# EAGLE design center (EAGLE 9.1.3)
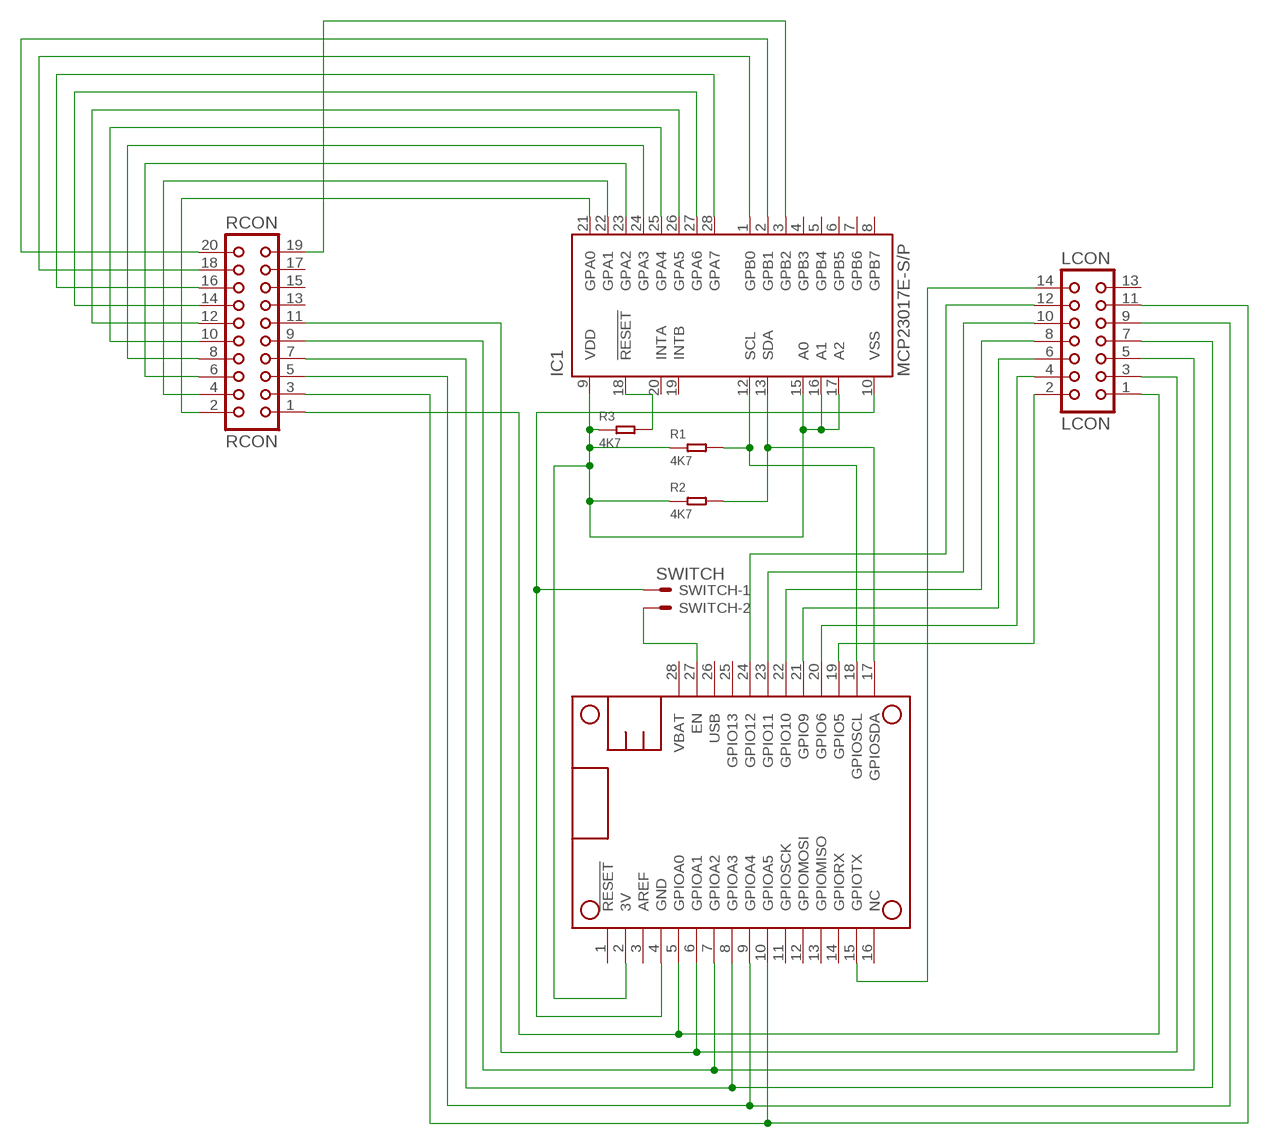
[diagram p0: schematic, sheet 1]

## Parts
IC1  MCP23017E-S/P  MCP23017SP  [DIL28-3]
LCON  LCON  CON14  [CON14]
MS1  FEATHERWING_NODIM  [FEATHERWING_DIM]
R1  4K7  DIP-RES-4.7K-5%-1/4W(PR-D2.3XL6.5MM)  [PR-D2.3XL6.5MM]
R2  4K7  DIP-RES-4.7K-5%-1/4W(PR-D2.3XL6.5MM)  [PR-D2.3XL6.5MM]
R3  4K7  DIP-RES-4.7K-5%-1/4W(PR-D2.3XL6.5MM)  [PR-D2.3XL6.5MM]
RCON  RCON  CON20  [CON20]
SWITCH  SWITCH  JST-XH-02-PIN-LONG-PAD  [JST-XH-02-PACKAGE-LONG-PAD]

## Nets
3V: IC1.9(VDD) IC1.15(A0) IC1.16(A1) IC1.17(A2) MS1.2(3V) R1.1 R2.1 R3.1
EN: MS1.27(EN) SWITCH.2
GND: IC1.10(VSS) MS1.4(GND) SWITCH.1
LCOL1: LCON.2 MS1.19(GPIO5)
LCOL2: LCON.4 MS1.20(GPIO6)
LCOL3: LCON.6 MS1.21(GPIO9)
LCOL4: LCON.8 MS1.22(GPIO10)
LCOL5: LCON.10 MS1.23(GPIO11)
LCOL6: LCON.12 MS1.24(GPIO12)
LCOL7: LCON.14 MS1.15(GPIOTX)
RCOL1: IC1.21(GPA0) RCON.2
RCOL2: IC1.22(GPA1) RCON.4
RCOL3: IC1.23(GPA2) RCON.6
RCOL4: IC1.24(GPA3) RCON.8
RCOL5: IC1.25(GPA4) RCON.10
RCOL6: IC1.26(GPA5) RCON.12
RCOL7: IC1.27(GPA6) RCON.14
RCOL8: IC1.28(GPA7) RCON.16
RCOL9: IC1.1(GPB0) RCON.18
RCOL10: IC1.2(GPB1) RCON.20
RCOL11: IC1.3(GPB2) RCON.19
RESET: IC1.18(!RESET) R3.2
ROW1: LCON.1 MS1.5(GPIOA0) RCON.1
ROW2: LCON.3 MS1.6(GPIOA1) RCON.11
ROW3: LCON.5 MS1.7(GPIOA2) RCON.9
ROW4: LCON.7 MS1.8(GPIOA3) RCON.7
ROW5: LCON.9 MS1.9(GPIOA4) RCON.5
ROW6: LCON.11 MS1.10(GPIOA5) RCON.3
SCL: IC1.12(SCL) MS1.18(GPIOSCL) R1.2
SDA: IC1.13(SDA) MS1.17(GPIOSDA) R2.2
Unconnected: IC1.4(GPB3) IC1.5(GPB4) IC1.6(GPB5) IC1.7(GPB6) IC1.8(GPB7) IC1.19(INTB) IC1.20(INTA) LCON.13 MS1.1(!RESET) MS1.3(AREF) MS1.11(GPIOSCK) MS1.12(GPIOMOSI) MS1.13(GPIOMISO) MS1.14(GPIORX) MS1.16(NC) MS1.25(GPIO13) MS1.26(USB) MS1.28(VBAT) RCON.13 RCON.15 RCON.17

## Library data of the parts
IC1 = adafruit:MCP23017: http://ww1.microchip.com/downloads/en/DeviceDoc/21952a.pdf Source: http://ww1.microchip.com/downloads/en/DeviceDoc/21952a.pdf
LCON = con-harting:CON14: CONNECTOR; OC_FARNELL: unknown; OC_NEWARK: unknown
MS1 = adafruit:FEATHERWING
R1-R3 = Seeed-Resistor:DIP-RES-4.7K-5%-1/4W(PR-D2.3XL6.5MM): 301020012; MPN: FHCFR-1/4W-472J; VALUE: 4.7K
RCON = con-harting:CON20: CONNECTOR; OC_FARNELL: unknown; OC_NEWARK: unknown
SWITCH = Rembrandt Electronics - JST XH Connectors v1-0:JST-XH-02-PIN: JST XH Connector 2 Pin Wire to board connector. Pitch: 2,54 mm, (0.100") Number of pins: 2 Created by Rembrandt Electronics www.rembrandtelectronics.com

## Board
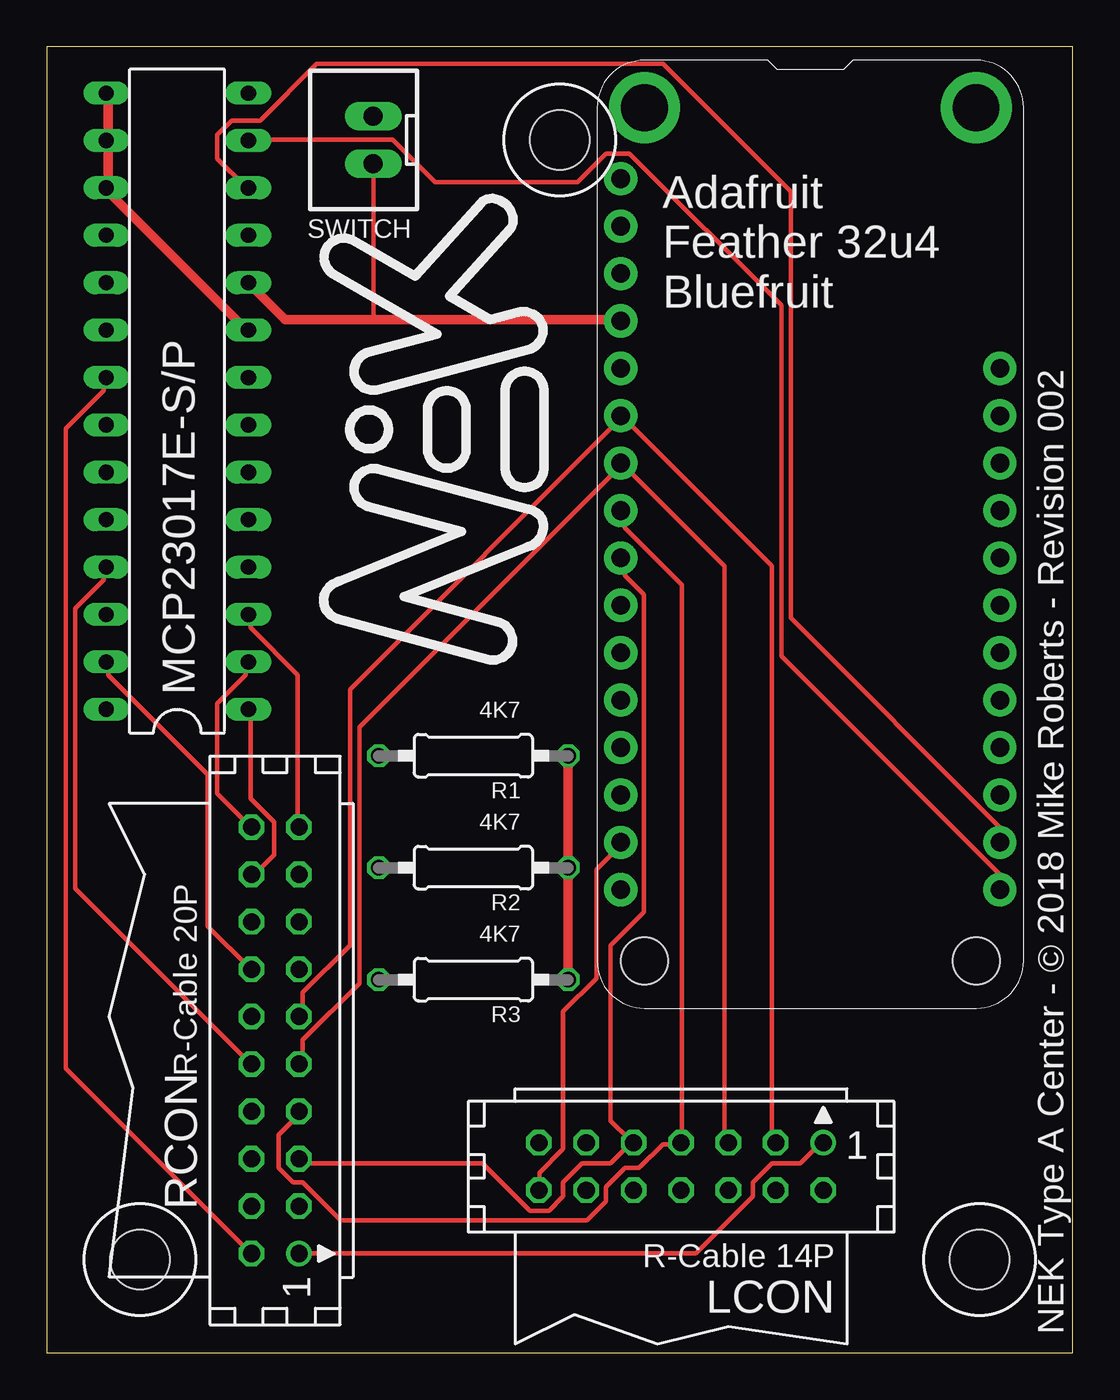
[diagram p1: board, top side]
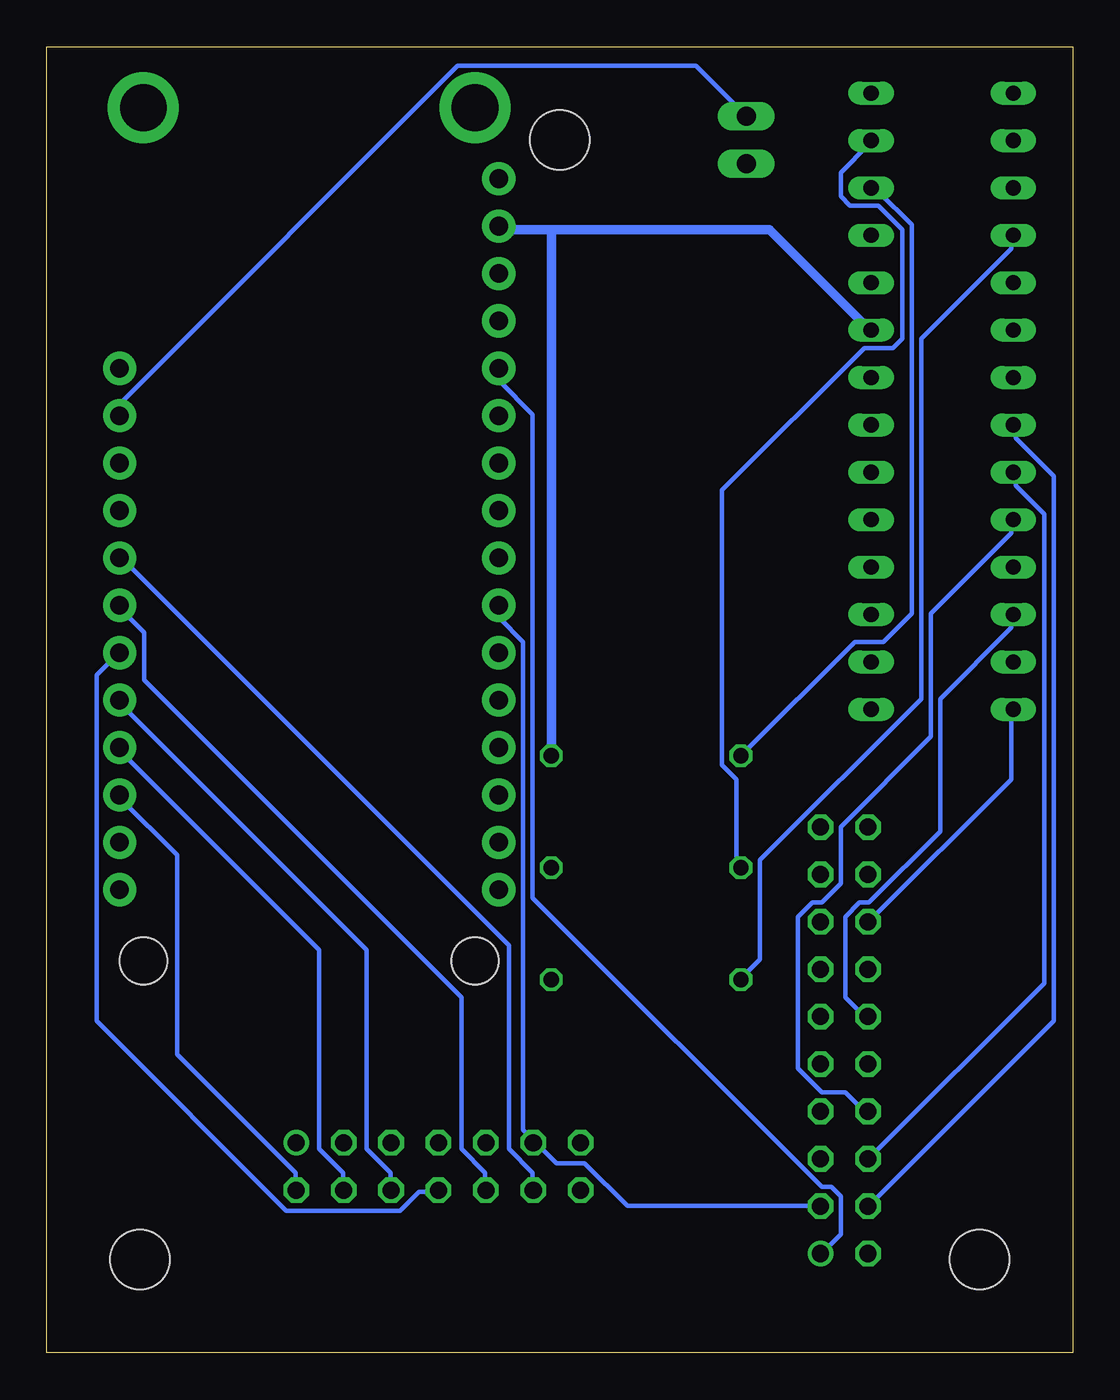
[diagram p2: board, bottom side, seen from below]

Size 55 x 70 mm. Coordinates in mm from the lower left corner, seen from the top.
Outline: 0,0 55,0 55,70 0,70 0,0
Copper layers (1*16): Top 0.035559375mm / dielectric 1.6mm / Bottom 0.035559375mm
Design rules "oshpark-2layer-auto-routing": minimum track width 10mil, minimum drill 10mil, track to track 10mil, track to pad 8mil, pad to pad 8mil, via to via 8mil, smd to smd 6mil, copper to edge 15mil, drill to drill 6mil, minimum pad ring 6mil, minimum via ring 6mil, stop-mask expansion 2.5mil, vias tented up to drill 0mil, thermal gap 10mil
Holes 3.2 mm at 50,5 5,5 27.5,65

### Footprints (pad centres in the part's own frame; a part is rotated, then mirrored left to right if it is on the bottom)
DIL28-3 = drill 0.813 long: 1 -16.51,-3.81; 2 -13.97,-3.81; 3 -11.43,-3.81; 4 -8.89,-3.81; 5 -6.35,-3.81; 6 -3.81,-3.81; 7 -1.27,-3.81; 8 1.27,-3.81; 9 3.81,-3.81; 10 6.35,-3.81; 11 8.89,-3.81; 12 11.43,-3.81; 13 13.97,-3.81; 14 16.51,-3.81; 15 16.51,3.81; 16 13.97,3.81; 17 11.43,3.81; 18 8.89,3.81; 19 6.35,3.81; 20 3.81,3.81; 21 1.27,3.81; 22 -1.27,3.81; 23 -3.81,3.81; 24 -6.35,3.81; 25 -8.89,3.81; 26 -11.43,3.81; 27 -13.97,3.81; 28 -16.51,3.81
CON14 = drill 0.914: 1 -7.62,-1.27 | drill 0.914 octagon: 2 -7.62,1.27; 3 -5.08,-1.27; 4 -5.08,1.27; 5 -2.54,-1.27; 6 -2.54,1.27; 7 0,-1.27; 8 0,1.27; 9 2.54,-1.27; 10 2.54,1.27; 11 5.08,-1.27; 12 5.08,1.27; 13 7.62,-1.27; 14 7.62,1.27
FEATHERWING_DIM = drill 1 pad 1.778: 1 6.35,1.27; 2 8.89,1.27; 3 11.43,1.27; 4 13.97,1.27; 5 16.51,1.27; 6 19.05,1.27; 7 21.59,1.27; 8 24.13,1.27; 9 26.67,1.27; 10 29.21,1.27; 11 31.75,1.27; 12 34.29,1.27; 13 36.83,1.27; 14 39.37,1.27; 15 41.91,1.27; 16 44.45,1.27; 17 44.45,21.59; 18 41.91,21.59; 19 39.37,21.59; 20 36.83,21.59; 21 34.29,21.59; 22 31.75,21.59; 23 29.21,21.59; 24 26.67,21.59; 25 24.13,21.59; 26 21.59,21.59; 27 19.05,21.59; 28 16.51,21.59 | drill 2.5 pad 3.81: P$1 2.54,20.32; P$2 2.54,2.54 | hole 2.54: 48.26,20.32; 48.26,2.54
PR-D2.3XL6.5MM = drill 0.813 octagon: 1 -4.953,0; 2 5.207,0
CON20 = drill 0.914: 1 -11.43,-1.27 | drill 0.914 octagon: 2 -11.43,1.27; 3 -8.89,-1.27; 4 -8.89,1.27; 5 -6.35,-1.27; 6 -6.35,1.27; 7 -3.81,-1.27; 8 -3.81,1.27; 9 -1.27,-1.27; 10 -1.27,1.27; 11 1.27,-1.27; 12 1.27,1.27; 13 3.81,-1.27; 14 3.81,1.27; 15 6.35,-1.27; 16 6.35,1.27; 17 8.89,-1.27; 18 8.89,1.27; 19 11.43,-1.27; 20 11.43,1.27
JST-XH-02-PACKAGE-LONG-PAD = drill 1.016 long: 1 -1.27,0; 2 1.27,0

### Placement (x,y rotation side)
IC1  7,51 90 top
LCON  34,9.99 180 top
MS1  29.5,69.27 270 top
R1  23,32 180 top
R2  23,26 180 top
R3  23,20 180 top
RCON  12.25,16.75 90 top
SWITCH  17.5,65 90 top

### Tracks (layer width: path | path; a pad name or v marks a point on that pad's centre or on a via)
3V
  Top 0.254: 27.94,20.07 R3.1 | 27.94,25.91 R2.1 27.94,26.16 | 27.94,31.75 R1.1 | 3.3,62.48 IC1.17 3.3,62.23 | 3.3,64.77 IC1.16 3.3,65.02 | 10.67,54.86 IC1.9 | 3.3,67.31 IC1.15
  Top 0.5: 27.94,25.91 27.94,20.07 | 27.94,26.16 27.94,31.75 | 3.3,64.77 3.3,62.48 | 3.3,62.23 10.67,54.86 | 3.3,65.02 3.3,67.31
  Bottom 0.254: 30.73,60.2 MS1.2 | 10.92,54.86 IC1.9 | R1.1
  Bottom 0.5: 27.94,60.2 16.26,60.2 10.92,54.86 | 27.94,60.2 30.73,60.2 | 27.94,60.2 R1.1
EN
  Bottom 0.254: SWITCH.2 20.2,68.97 32.97,68.97 51.09,50.84 MS1.27
GND
  Top 0.254: 30.73,55.37 MS1.4 | 17.53,55.37 17.53,63.5 SWITCH.1
  Top 0.5: 30.73,55.37 25.4,55.37 17.53,55.37 12.79,55.37 IC1.10
LCOL1
  Bottom 0.254: LCON.2 41.66,8.89 41.66,9.65 48.01,16 48.01,26.67 51.05,29.72 MS1.19
LCOL2
  Bottom 0.254: LCON.4 39.12,8.89 39.12,9.65 40.39,10.92 40.39,21.59 51.05,32.26 MS1.20
LCOL3
  Bottom 0.254: LCON.6 36.58,8.89 36.58,9.65 37.85,10.92 37.85,21.59 51.05,34.8 MS1.21
LCOL4
  Bottom 0.254: LCON.8 34.04,8.64 35.05,8.64 36.07,7.62 42.16,7.62 52.32,17.78 52.32,36.32 51.31,37.34 MS1.22
LCOL5
  Bottom 0.254: LCON.10 31.5,8.89 31.5,9.65 32.77,10.92 32.77,19.05 49.78,36.07 49.78,38.61 51.05,39.88 MS1.23
LCOL6
  Bottom 0.254: LCON.12 28.96,8.89 28.96,9.65 30.23,10.92 30.23,21.84 51.05,42.67 MS1.24
LCOL7
  Top 0.254: LCON.14 26.42,8.89 26.42,9.65 27.69,10.92 27.69,18.29 29.46,20.07 29.46,25.91 30.73,27.18 MS1.15
RCOL1
  Top 0.254: IC1.21 3.05,52.07 3.05,51.56 1.02,49.53 1.02,15.24 10.92,5.33 RCON.2
RCOL2
  Bottom 0.254: IC1.22 3.05,49.53 3.05,49.02 1.02,46.99 1.02,17.78 10.92,7.87 RCON.4
RCOL3
  Bottom 0.254: IC1.23 3.05,46.99 3.05,46.48 1.52,44.96 1.52,19.81 10.92,10.41 RCON.6
RCOL4
  Bottom 0.254: IC1.24 3.3,44.45 3.3,43.94 7.62,39.62 7.62,33.02 12.45,28.19 12.45,25.15 13.46,24.13 13.97,24.13 14.73,23.37 14.73,15.24 13.46,13.97 12.19,13.97 11.18,12.95 RCON.8
RCOL5
  Top 0.254: IC1.25 3.05,41.91 3.05,41.4 1.52,39.88 1.52,24.89 10.92,15.49 RCON.10
RCOL6
  Bottom 0.254: IC1.26 3.3,39.37 3.3,38.86 7.11,35.05 7.11,27.94 10.92,24.13 11.43,24.13 12.19,23.37 12.19,19.05 11.18,18.03 RCON.12
RCOL7
  Top 0.254: IC1.27 3.3,36.83 3.3,36.32 8.64,30.99 8.64,22.86 10.92,20.57 RCON.14
RCOL8
  Bottom 0.254: IC1.28 3.3,34.29 3.3,30.73 10.92,23.11 RCON.16
RCOL9
  Top 0.254: IC1.1 10.92,34.29 10.92,29.72 12.19,28.45 12.19,26.67 11.18,25.65 RCON.18
RCOL10
  Top 0.254: IC1.2 10.67,36.83 10.67,36.32 9.14,34.8 9.14,29.97 10.92,28.19 RCON.20
RCOL11
  Top 0.254: IC1.3 10.92,39.37 10.92,38.86 13.46,36.32 13.46,28.19 RCON.19
RESET
  Bottom 0.254: IC1.18 3.3,59.69 3.3,59.18 8.13,54.36 8.13,35.05 16.76,26.42 16.76,21.08 17.78,20.07 R3.2
ROW1
  Top 0.254: RCON.1 13.72,5.33 34.8,5.33 37.85,8.38 37.85,9.14 38.86,10.16 40.39,10.16 41.4,11.18 LCON.1
  Bottom 0.254: MS1.5 30.73,52.58 30.73,52.07 28.96,50.29 28.96,24.38 13.46,8.89 12.95,8.89 12.45,8.38 12.45,6.35 13.46,5.33 RCON.1
ROW2
  Top 0.254: LCON.3 38.86,11.43 38.86,42.16 30.99,50.04 MS1.6 30.73,50.04 16.26,35.56 16.26,21.84 13.72,19.3 13.72,18.03 RCON.11
ROW3
  Top 0.254: LCON.5 36.32,11.43 36.32,42.16 30.99,47.5 MS1.7 30.73,47.5 16.76,33.53 16.76,19.81 13.72,16.76 13.72,15.49 RCON.9
ROW4
  Top 0.254: RCON.7 13.46,12.7 12.45,11.68 12.45,9.91 13.21,9.14 13.72,9.14 15.75,7.11 28.96,7.11 29.97,8.13 29.97,8.89 30.99,9.91 31.75,9.91 33.02,11.18 33.78,11.18 LCON.7 34.04,11.43 34.04,41.15 30.99,44.2 30.99,44.96 MS1.8
ROW5
  Top 0.254: RCON.5 13.72,10.16 23.37,10.16 25.91,7.62 26.92,7.62 27.69,8.38 27.69,9.14 28.7,10.16 30.23,10.16 31.24,11.18 LCON.9 31.24,11.43 30.23,12.45 30.23,21.84 32,23.62 32,40.64 30.99,41.66 30.99,42.42 MS1.9
ROW6
  Bottom 0.254: RCON.3 13.72,7.87 23.88,7.87 26.16,10.16 27.69,10.16 28.7,11.18 LCON.11 28.96,11.43 29.46,11.94 29.46,38.1 30.73,39.37 30.73,39.88 MS1.10
SCL
  Top 0.254: MS1.18 51.05,27.43 51.05,28.19 39.88,39.37 39.88,62.23 33.02,69.09 14.48,69.09 11.43,66.04 9.91,66.04 9.14,65.28 9.14,64.01 10.67,62.48 IC1.12
  Bottom 0.254: IC1.12 10.67,62.23 10.41,62.23 8.64,60.45 8.64,39.62 10.16,38.1 11.68,38.1 R1.2
SDA
  Top 0.254: MS1.17 51.05,24.89 51.05,25.65 39.37,37.34 39.37,56.13 31.24,64.26 29.97,64.26 28.45,62.74 20.83,62.74 18.54,65.02 10.92,65.02 IC1.13
  Bottom 0.254: R2.2 18.03,26.16 18.03,30.73 18.8,31.5 18.8,46.23 11.18,53.85 9.65,53.85 9.14,54.36 9.14,60.2 10.41,61.47 11.94,61.47 12.45,61.98 12.45,63.25 10.92,64.77 IC1.13

### Text on the board
tNames: Adafruit / Feather 32u4 / Bluefruit | NEK Type A Center - © 2018 Mike Roberts - Revision 002